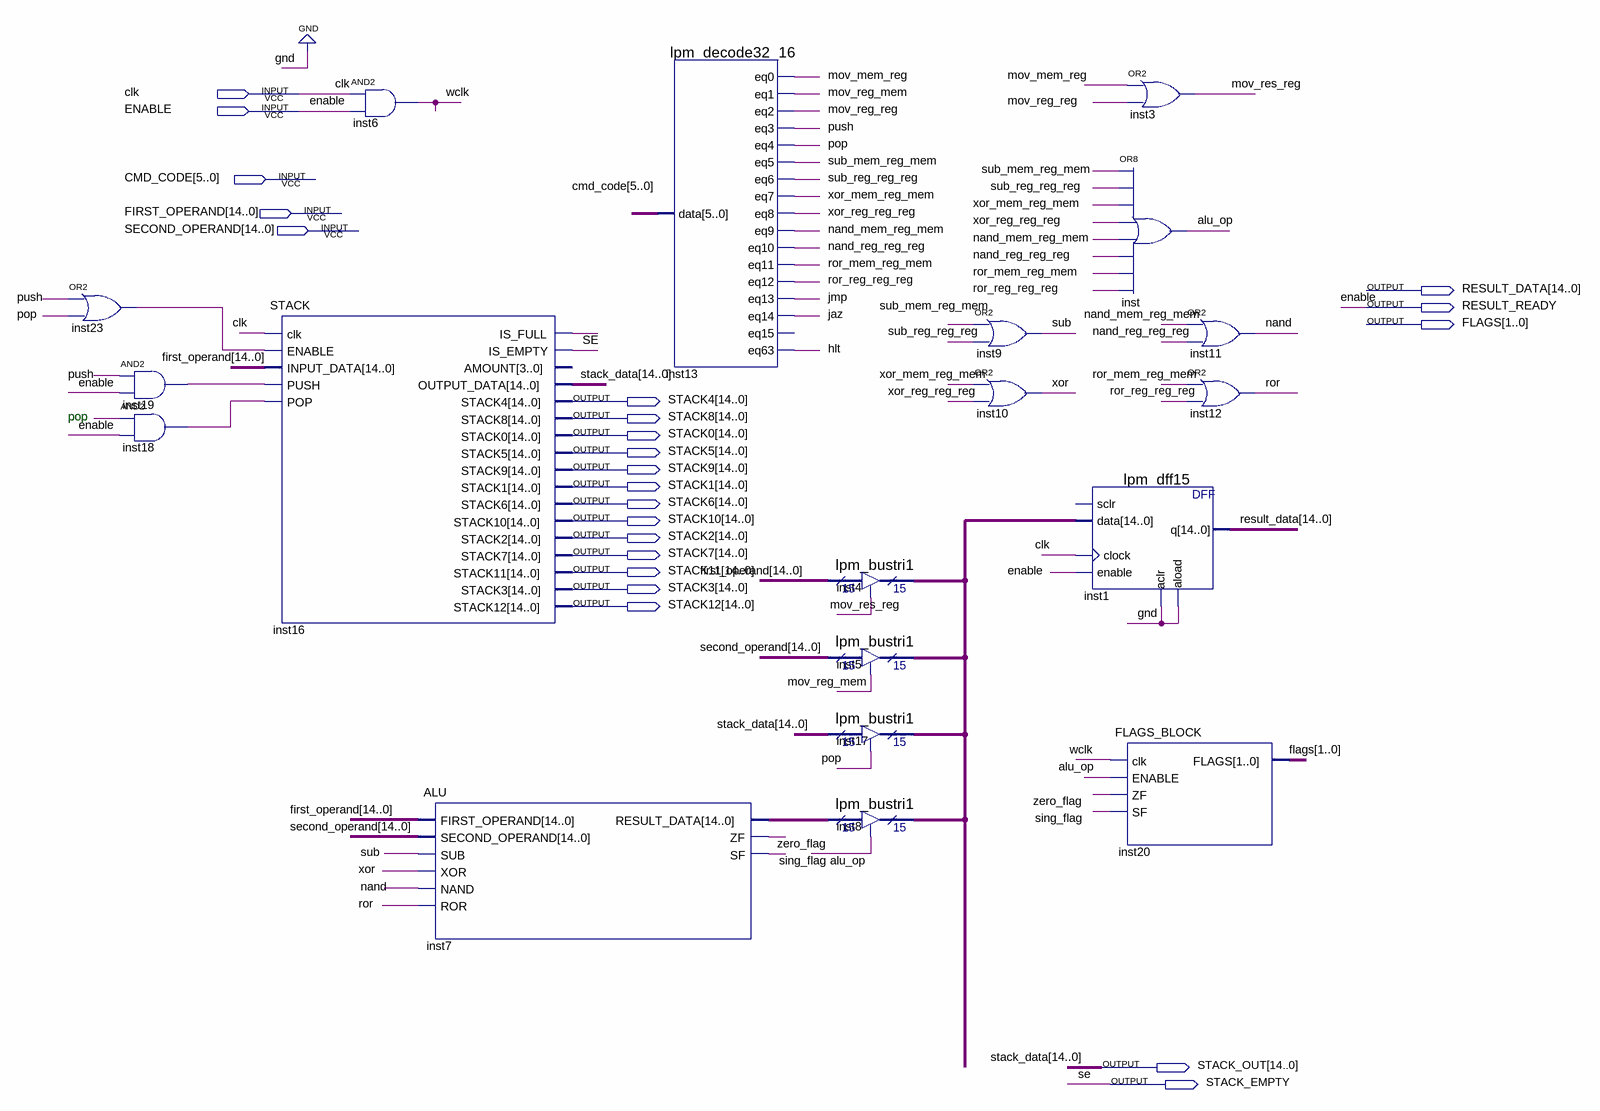
[diagram p0: schematic sheet]
// Quartus schematic EXECUTER.bdf as structural Verilog: 19 symbols, 23 pins
module EXECUTER (
  input  clk,
  input  ENABLE,
  input  [5:0] CMD_CODE,
  input  [14:0] FIRST_OPERAND,
  input  [14:0] SECOND_OPERAND,
  output [14:0] RESULT_DATA,
  output RESULT_READY,
  output [1:0] FLAGS,
  output [14:0] STACK4,
  output [14:0] STACK8,
  output [14:0] STACK0,
  output [14:0] STACK5,
  output [14:0] STACK9,
  output [14:0] STACK1,
  output [14:0] STACK6,
  output [14:0] STACK10,
  output [14:0] STACK2,
  output [14:0] STACK7,
  output [14:0] STACK11,
  output [14:0] STACK3,
  output [14:0] STACK12,
  output [14:0] STACK_OUT,
  output STACK_EMPTY
);

  wire alu_op, hlt, inst16_is_full, inst18_out, inst19_out, inst23_out, jaz, jmp, mov_mem_reg, mov_reg_mem,
       mov_reg_reg, mov_res_reg, \nand , nand_mem_reg_mem, nand_reg_reg_reg, pop, push, ror, ror_mem_reg_mem,
       ror_reg_reg_reg, sing_flag, sub, sub_mem_reg_mem, sub_reg_reg_reg, wclk, \xor , xor_mem_reg_mem,
       xor_reg_reg_reg, zero_flag;
  wire [14:0] inst4_tridata, inst7_result_data;

  or inst23 (inst23_out, push, pop);
  and inst19 (inst19_out, push, ENABLE);
  and inst18 (inst18_out, pop, ENABLE);
  STACK inst16 (
    .clk(clk), .ENABLE(inst23_out), .INPUT_DATA(FIRST_OPERAND), .PUSH(inst19_out), .POP(inst18_out),
    .IS_FULL(inst16_is_full), .IS_EMPTY(STACK_EMPTY), .OUTPUT_DATA(STACK_OUT), .STACK4(STACK4),
    .STACK8(STACK8), .STACK0(STACK0), .STACK5(STACK5), .STACK9(STACK9), .STACK1(STACK1), .STACK6(STACK6),
    .STACK10(STACK10), .STACK2(STACK2), .STACK7(STACK7), .STACK11(STACK11), .STACK3(STACK3), .STACK12(STACK12));  // open: AMOUNT
  and inst6 (wclk, clk, ENABLE);
  ALU inst7 (
    .FIRST_OPERAND(FIRST_OPERAND), .SECOND_OPERAND(SECOND_OPERAND), .SUB(sub), .XOR(\xor ), .NAND(\nand ),
    .ROR(ror), .RESULT_DATA(inst7_result_data), .ZF(zero_flag), .SF(sing_flag));
  lpm_decode32_16 inst13 (
    .data(CMD_CODE), .eq0(mov_mem_reg), .eq1(mov_reg_mem), .eq2(mov_reg_reg), .eq3(push), .eq4(pop),
    .eq5(sub_mem_reg_mem), .eq6(sub_reg_reg_reg), .eq7(xor_mem_reg_mem), .eq8(xor_reg_reg_reg),
    .eq9(nand_mem_reg_mem), .eq10(nand_reg_reg_reg), .eq11(ror_mem_reg_mem), .eq12(ror_reg_reg_reg),
    .eq13(jmp), .eq14(jaz), .eq63(hlt));  // open: eq15
  lpm_bustri1 inst4 (.enabledt(mov_res_reg), .data(FIRST_OPERAND), .tridata(inst4_tridata));
  lpm_bustri1 inst5 (.enabledt(mov_reg_mem), .data(SECOND_OPERAND), .tridata(inst4_tridata));
  lpm_bustri1 inst17 (.enabledt(pop), .data(STACK_OUT), .tridata(inst4_tridata));
  lpm_bustri1 inst8 (.enabledt(alu_op), .data(inst7_result_data), .tridata(inst4_tridata));
  or inst9 (sub, sub_mem_reg_mem, sub_reg_reg_reg);
  or inst10 (\xor , xor_mem_reg_mem, xor_reg_reg_reg);
  lpm_dff15 inst1 (
    .data(inst4_tridata), .clock(clk), .enable(ENABLE), .aclr(1'b0), .aload(1'b0), .q(RESULT_DATA));  // open: sclr
  FLAGS_BLOCK inst20 (.clk(wclk), .ENABLE(alu_op), .ZF(zero_flag), .SF(sing_flag), .FLAGS(FLAGS));
  or inst3 (mov_res_reg, mov_mem_reg, mov_reg_reg);
  or inst (alu_op, sub_mem_reg_mem, sub_reg_reg_reg, xor_mem_reg_mem, xor_reg_reg_reg, nand_mem_reg_mem, nand_reg_reg_reg, ror_mem_reg_mem, ror_reg_reg_reg);
  or inst11 (\nand , nand_mem_reg_mem, nand_reg_reg_reg);
  or inst12 (ror, ror_mem_reg_mem, ror_reg_reg_reg);

  assign RESULT_READY = ENABLE;

  // Other names for the same wires on the sheet: SE = STACK_EMPTY; stack_data[14:0] = STACK_OUT

  // Notes on the sheet:
  //   pop
endmodule
